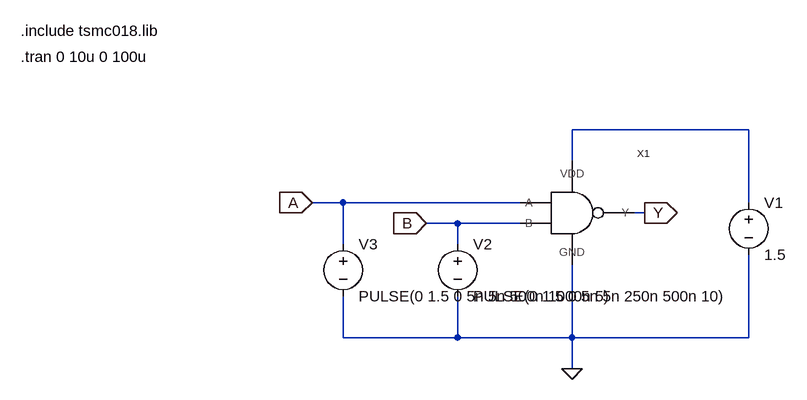
[diagram p0: schematic cmos_NAND_tb.asc]
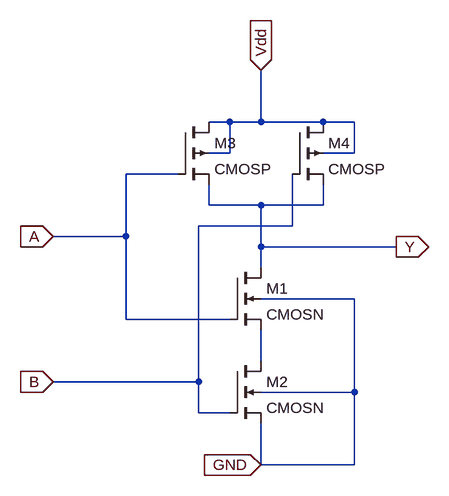
[diagram p1: sub-circuit cmos_nand.asc]
cmos_NAND_tb.asc, the LTspice schematic file:
Version 4
SHEET 1 880 680
WIRE 480 48 208 48
WIRE 208 96 208 48
WIRE -144 160 -192 160
WIRE 128 160 -144 160
WIRE 480 160 480 48
WIRE 320 176 304 176
WIRE 32 192 -16 192
WIRE 128 192 32 192
WIRE -144 224 -144 160
WIRE 32 224 32 192
WIRE -144 368 -144 304
WIRE 32 368 32 304
WIRE 32 368 -144 368
WIRE 208 368 208 256
WIRE 208 368 32 368
WIRE 480 368 480 240
WIRE 480 368 208 368
WIRE 208 416 208 368
FLAG 208 416 0
FLAG 320 176 Y
IOPIN 320 176 Out
FLAG -192 160 A
IOPIN -192 160 In
FLAG -16 192 B
IOPIN -16 192 In
SYMBOL cmos_NAND 208 144 R0
SYMATTR InstName X1
SYMBOL voltage 480 144 R0
WINDOW 123 0 0 Left 0
WINDOW 39 0 0 Left 0
SYMATTR InstName V1
SYMATTR Value 1.5
SYMBOL voltage 32 208 R0
WINDOW 123 0 0 Left 0
WINDOW 39 0 0 Left 0
SYMATTR InstName V2
SYMATTR Value PULSE(0 1.5 0 5n 5n 250n 500n 10)
SYMBOL voltage -144 208 R0
WINDOW 123 0 0 Left 0
WINDOW 39 0 0 Left 0
SYMATTR InstName V3
SYMATTR Value PULSE(0 1.5 0 5n 5n 500n 1000n 5)
TEXT -640 -104 Left 2 !.include tsmc018.lib
TEXT -640 -64 Left 2 !.tran 0 10u 0 100u

cmos_nand.asc, the sub-circuit schematic file:
Version 4
SHEET 1 880 680
WIRE 224 -144 192 -144
WIRE 272 -144 272 -224
WIRE 272 -144 224 -144
WIRE 368 -144 272 -144
WIRE 416 -144 368 -144
WIRE 224 -96 224 -144
WIRE 224 -96 192 -96
WIRE 416 -96 416 -144
WIRE 416 -96 368 -96
WIRE 144 -64 64 -64
WIRE 192 -16 192 -48
WIRE 272 -16 192 -16
WIRE 368 -16 368 -48
WIRE 368 -16 272 -16
WIRE 320 16 320 -64
WIRE 320 16 176 16
WIRE 64 32 64 -64
WIRE 64 32 -48 32
WIRE 272 48 272 -16
WIRE 480 48 272 48
WIRE 272 80 272 48
WIRE 416 128 272 128
WIRE 64 160 64 32
WIRE 224 160 64 160
WIRE 272 224 272 176
WIRE 176 256 176 16
WIRE 176 256 -48 256
WIRE 416 272 416 128
WIRE 416 272 272 272
WIRE 176 304 176 256
WIRE 224 304 176 304
WIRE 272 384 272 320
WIRE 416 384 416 272
WIRE 416 384 272 384
FLAG 480 48 Y
IOPIN 480 48 Out
FLAG -48 32 A
IOPIN -48 32 In
FLAG -48 256 B
IOPIN -48 256 In
FLAG 272 -224 Vdd
IOPIN 272 -224 In
FLAG 272 384 GND
IOPIN 272 384 In
SYMBOL cmosn 224 80 R0
SYMATTR InstName M1
SYMBOL cmosn 224 224 R0
SYMATTR InstName M2
SYMBOL cmosp 144 -144 R0
SYMATTR InstName M3
SYMBOL cmosp 320 -144 R0
SYMATTR InstName M4

The netlist it stands for:
* cmos_NAND_tb.asc
XX1 N001 0 A B Y cmos_nand
V1 N001 0 1.5
V2 B 0 PULSE(0 1.5 0 5n 5n 250n 500n 10)
V3 A 0 PULSE(0 1.5 0 5n 5n 500n 1000n 5)

* block symbol definitions
.subckt cmos_nand VDD GND A B Y
M1 Y A N001 GND CMOSN
M2 N001 B GND GND CMOSN
M3 Vdd A Y Vdd CMOSP
M4 Vdd B Y Vdd CMOSP
.ends cmos_nand

.model NMOS NMOS
.model PMOS PMOS
.lib standard.mos
.include tsmc018.lib
.tran 0 10u 0 100u
.backanno
.end